# EAGLE board BaseBoard5 (EAGLE 6.5.0), part 1 of 2
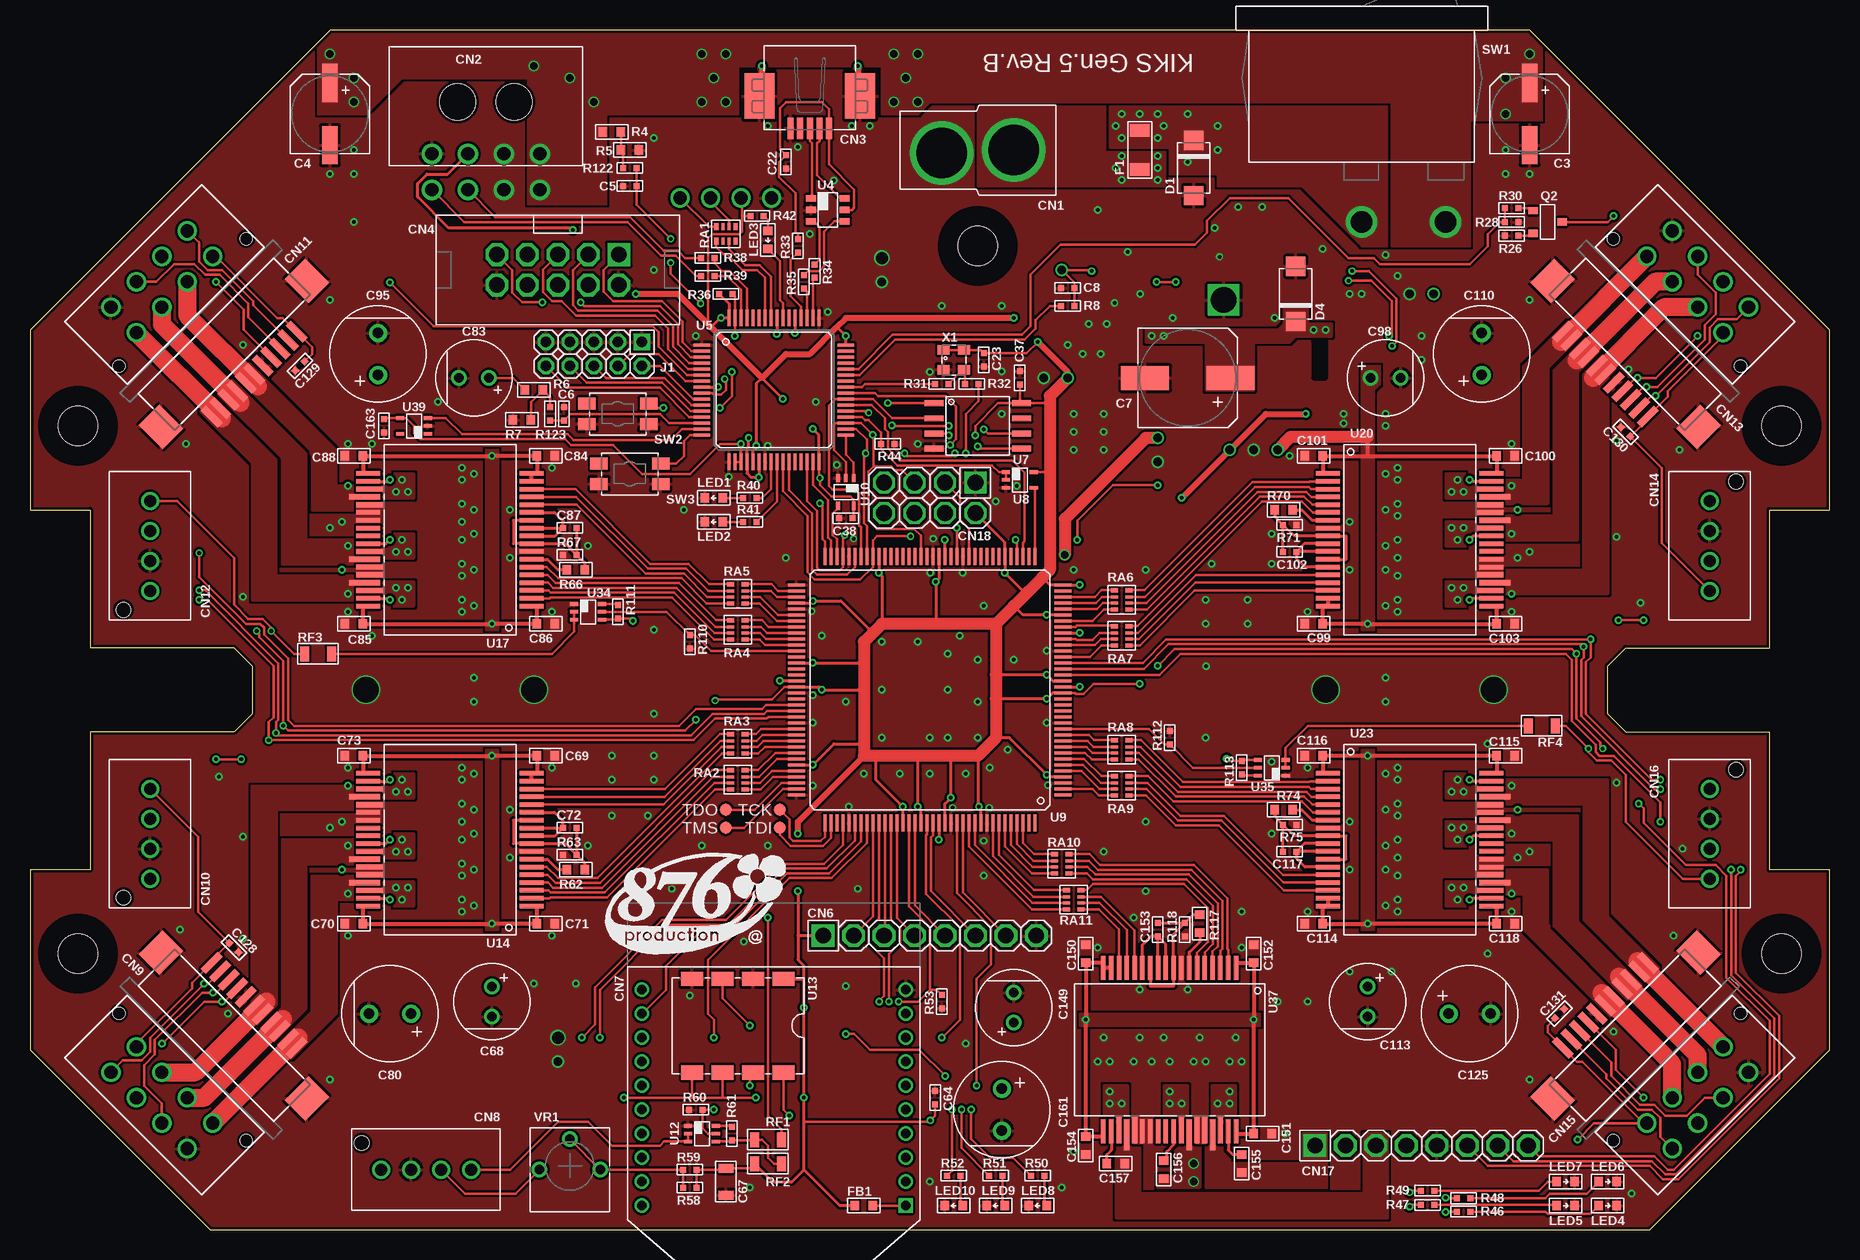
[diagram p8: board, top side]
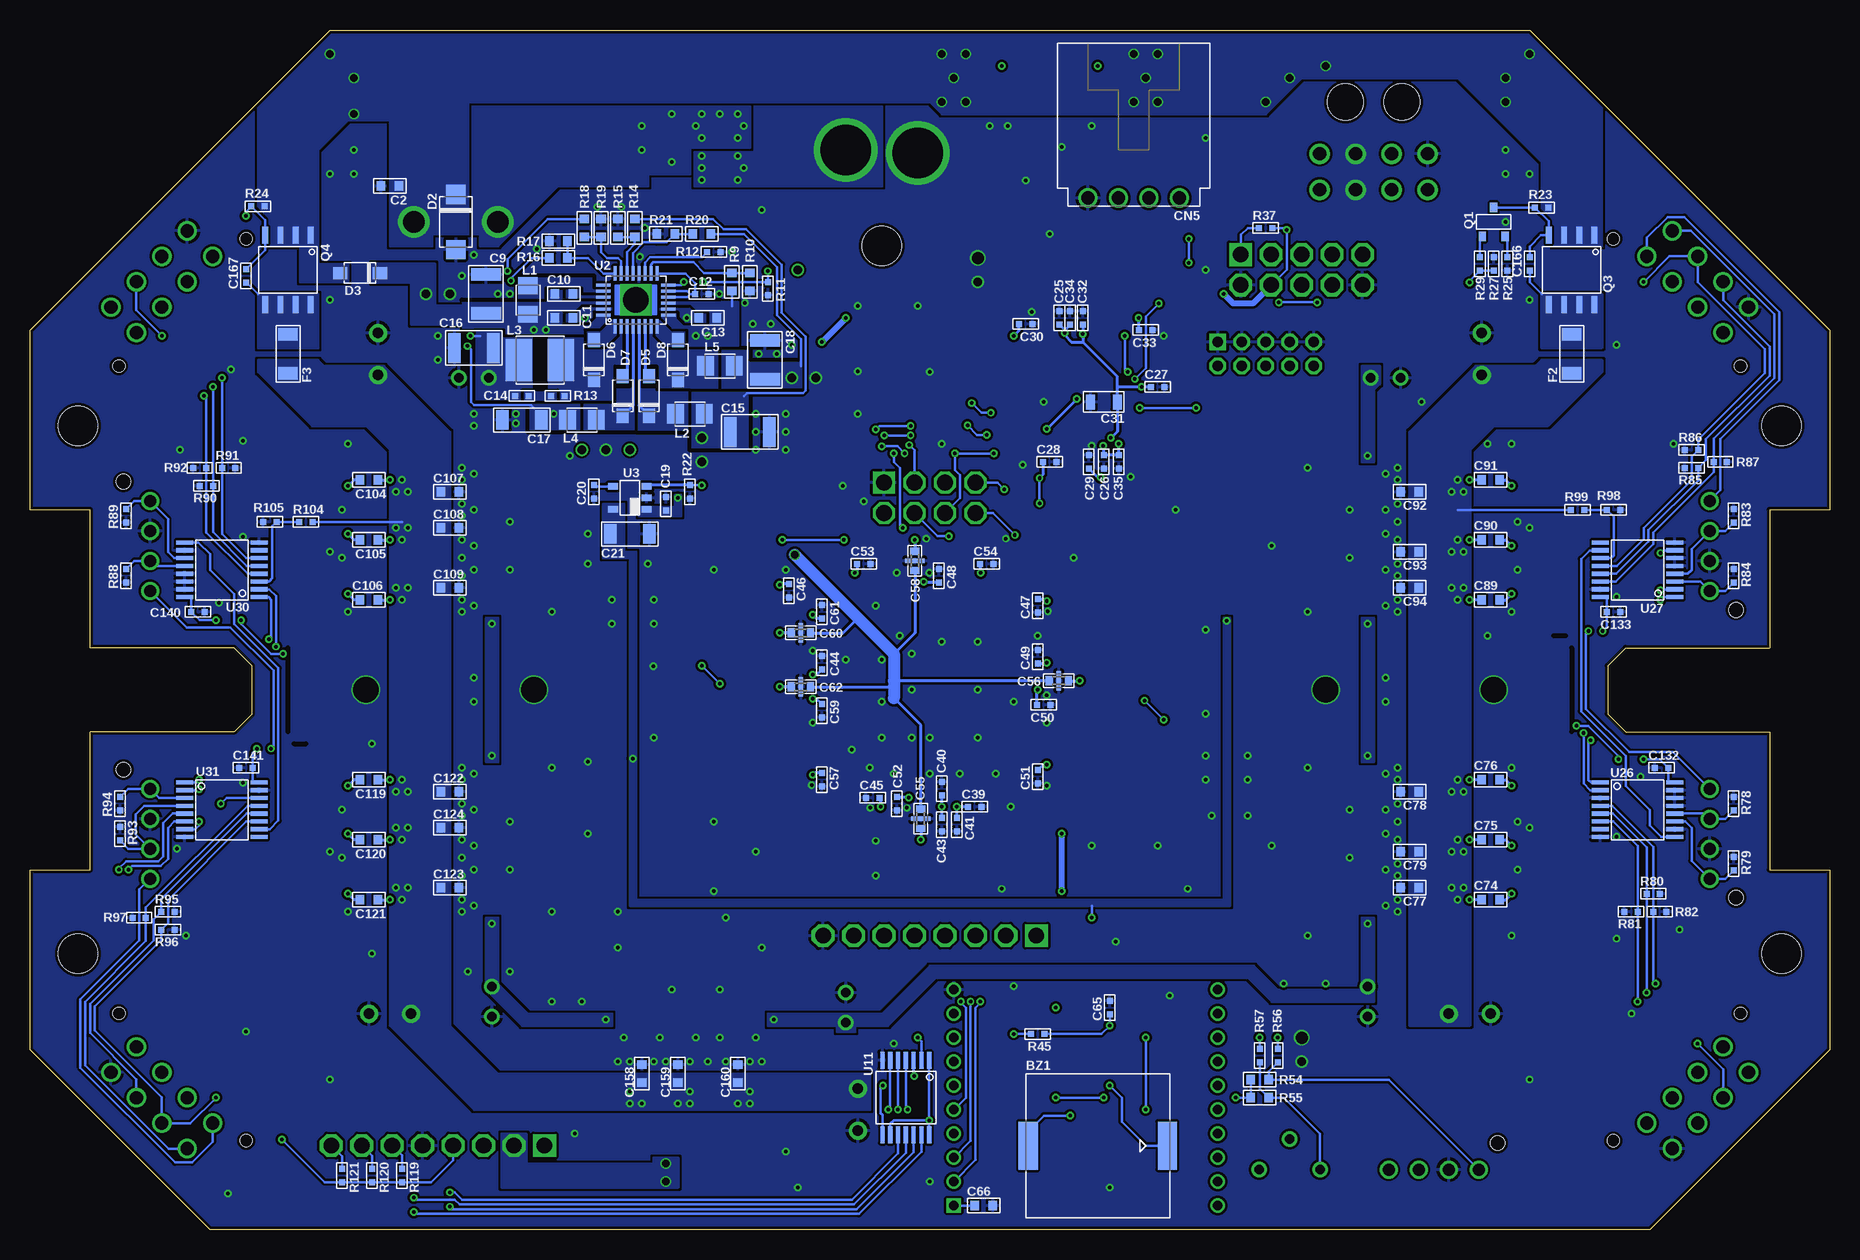
[diagram p9: board, bottom side, seen from below]

Size 150 x 100 mm. Coordinates in mm from the lower left corner, seen from the top.
Outline: 15,0 135,0 150,15 150,30 145,30 145,41.5 133,41.5 131.5,43 131.5,47 133,48.5 145,48.5 145,60 150,60 150,75 125,100 25,100 0,75 0,60 5,60 5,48.5 17,48.5 18.5,47 18.5,43 17,41.5 5,41.5 5,30 0,30 0,15 15,0
Copper layers (1*16): Top 0.035mm / dielectric 1.5mm / Bottom 0.035mm
Design rules "Elecrow_2-layer_eagle_rule *": minimum track width 6mil, minimum drill 0.3mm, track to track 6mil, track to pad 6mil, pad to pad 6mil, via to via 6mil, smd to smd 0mil, copper to edge 10mil, drill to drill 10mil, minimum pad ring 8mil, minimum via ring 6mil, stop-mask expansion 2mil, vias tented up to drill 100mil, thermal gap 10mil
Holes 3.3 mm at 4,67 4,23 146,23 146,67 79,82
tRestrict: area 76,79 to 82,85; area 1,64 to 7,70; area 1,20 to 7,26; area 143,20 to 149,26; area 143,64 to 149,70; 4 lines
bRestrict: 119 lines

## Footprints (pad centres in the part's own frame; a part is rotated, then mirrored left to right if it is on the bottom)
PKLCS1212 = smd 1.6 x 4: 1 -5.8,0; 2 5.8,0
1608 = smd 0.7 x 0.8: 1 -0.75,0; 2 0.75,0
ES-6.3 = smd 3.2 x 1.3: N 2.6,0; P -2.6,0
1005 = smd 0.5 x 0.5: 1 -0.55,0; 2 0.55,0
ES2-8 = smd 4 x 2: N 3.55,0; P -3.55,0
3225 = smd 1.05 x 2.5: 1 -1.625,0; 2 1.625,0
3216 = smd 1.05 x 1.6: 1 -1.625,0; 2 1.625,0
2012 = smd 0.75 x 1.25: 1 -1.125,0; 2 1.125,0
NFM18 = smd 0.6 x 0.8: 1 -0.8,0; 2 0.8,0 | smd 0.4 x 1.6: GND 0,0
E2.5-6.3 = drill 0.8 pad 1.3: N 1.25,0; P -1.25,0
E3.5-8 = drill 0.9 pad 1.5: N 1.75,0; P -1.75,0
T-CON = drill 4.2 pad 5.3: N -3,-0.25; P 3,0
43045-0800 = drill 1.1 pad 1.7: 1 -4.5,-4.32; 2 -1.5,-4.32; 3 1.5,-4.32; 4 4.5,-4.32; 5 -4.5,-7.32; 6 -1.5,-7.32; 7 1.5,-7.32; 8 4.5,-7.32 | hole 3: 2.35,0; -2.35,0
UX60SC-MB-5ST = smd 1.8 x 0.5: 1 2.7,1.6; 2 2.7,0.8; 3 2.7,0; 4 2.7,-0.8; 5 2.7,-1.6 | smd 3.8 x 2.5: S1 0,-4.2; S2 0,4.2
PIN2X5-BOX = drill 1.3 pad 1.9 square: 1 -5.08,-1.27 | drill 1.3 pad 1.9 octagon: 2 -5.08,1.27; 3 -2.54,-1.27; 4 -2.54,1.27; 5 0,-1.27; 6 0,1.27; 7 2.54,-1.27; 8 2.54,1.27; 9 5.08,-1.27; 10 5.08,1.27
70553-0003 = drill 1.1 pad 1.6: 1 3.81,0; 2 1.27,0; 3 -1.27,0; 4 -3.81,0
PIN1X8 = drill 1.3 pad 1.9 square: 1 -8.89,0 | drill 1.3 pad 1.9 octagon: 2 -6.35,0; 3 -3.81,0; 4 -1.27,0; 5 1.27,0; 6 3.81,0; 7 6.35,0; 8 8.89,0
XBEE-TH = drill 0.8 square: 1 -11,9 | drill 0.8: 2 -11,7; 3 -11,5; 4 -11,3; 5 -11,1; 6 -11,-1; 7 -11,-3; 8 -11,-5; 9 -11,-7; 10 -11,-9; 11 11,-9; 12 11,-7; 13 11,-5; 14 11,-3; 15 11,-1; 16 11,1; 17 11,3; 18 11,5; 19 11,7; 20 11,9
53375-04 = drill 1 pad 1.5: 1 3.75,0; 2 1.25,0; 3 -1.25,0; 4 -3.75,0 | hole 1.2: 5.35,-2.2
MOTOR_COMPLEX2 = smd 0.6 x 2: 1.1 5,-2.4; 1.2 4,-2.4; 1.3 3,-2.4; 1.4 2,-2.4; 1.5 1,-2.4; 1.6 0,-2.4; 1.7 -1,-2.4; 1.8 -2,-2.4; 1.9 -3,-2.4; 1.10 -4,-2.4; 1.11 -5,-2.4 | drill 1.1 pad 1.5: 2.1 -4.5,10; 2.2 -1.5,10; 2.3 1.5,10; 2.4 4.5,10; 2.5 -4.5,7; 2.6 -1.5,7; 2.7 1.5,7; 2.8 4.5,7 | smd 2.4 x 2.8: S1 -8.6,0; S2 8.6,0 | hole 1: -7.5,6.06; 7.5,6.06
PIN2X4 = drill 1.3 square: 1 -3.81,-1.27 | drill 1.3 octagon: 2 -3.81,1.27; 3 -1.27,-1.27; 4 -1.27,1.27; 5 1.27,-1.27; 6 1.27,1.27; 7 3.81,-1.27; 8 3.81,1.27
DO-214AC = smd 1.6 x 1.6: A 2.3,0; K -2.3,0
SOD123W = smd 1.2 x 1: A 1.65,0; K -1.65,0
PIN2X5-2.0 = drill 0.9 pad 1.3 square: 1 -4,-1 | drill 0.9 pad 1.3 octagon: 2 -4,1; 3 -2,-1; 4 -2,1; 5 0,-1; 6 0,1; 7 2,-1; 8 2,1; 9 4,-1; 10 4,1
L2520 = smd 1.4 x 1.65: 1 -1.2,0; 2 1.2,0
L4040 = smd 2.2 x 3.5: 1 -1.75,0; 2 1.75,0
1608' = smd 0.7 x 0.8: A 0.75,0; K -0.75,0
PAD = smd 1 x 1: 1 0,0
SOT23-3 = smd 0.6 x 0.8: 1 -0.95,-1.2; 2 0.95,-1.2; 3 0,1.2
SOP8 = smd 0.48 x 1.4: 1 -1.905,-2.9; 2 -0.635,-2.9; 3 0.635,-2.9; 4 1.905,-2.9; 5 1.905,2.9; 6 0.635,2.9; 7 -0.635,2.9; 8 -1.905,2.9
1005-A4 = smd 0.6 x 0.35: A1 -0.6,0.8; A2 0.6,0.8; D1 -0.6,-0.8; D2 0.6,-0.8 | smd 0.6 x 0.25: B1 -0.6,0.25; B2 0.6,0.25; C1 -0.6,-0.25; C2 0.6,-0.25
SLE6_10A4 = drill 1.8 pad 2.6: 1 0,7; P 0,0
EVQ-P2_P9 = smd 1.45 x 1: A1 -2.575,-0.85; A2 2.575,-0.85; B1 -2.575,0.85; B2 2.575,0.85
QFN28-0.5-PAD = smd 1.2 x 0.25: 1 -2.2,1.75; 2 -2.2,1.25; 3 -2.2,0.75; 4 -2.2,0.25; 5 -2.2,-0.25; 6 -2.2,-0.75; 7 -2.2,-1.25; 8 -2.2,-1.75; 15 2.2,-1.75; 16 2.2,-1.25; 17 2.2,-0.75; 18 2.2,-0.25; 19 2.2,0.25; 20 2.2,0.75; 21 2.2,1.25; 22 2.2,1.75 | smd 0.25 x 1.2: 9 -1.25,-2.7; 10 -0.75,-2.7; 11 -0.25,-2.7; 12 0.25,-2.7; 13 0.75,-2.7; 14 1.25,-2.7; 23 1.25,2.7; 24 0.75,2.7; 25 0.25,2.7; 26 -0.25,2.7; 27 -0.75,2.7; 28 -1.25,2.7 | drill 2.1 pad 2.6 square: PAD 0,0
SOT23-5 = smd 0.55 x 0.85: 1 -0.95,-1.4; 2 0,-1.4; 3 0.95,-1.4; 4 0.95,1.4; 5 -0.95,1.4
SOT23-6 = smd 0.55 x 0.85: 1 -0.95,-1.4; 2 0,-1.4; 3 0.95,-1.4; 4 0.95,1.4; 5 0,1.4; 6 -0.95,1.4
QFP64-0.5 = smd 1.4 x 0.25: 1 -6,3.75; 2 -6,3.25; 3 -6,2.75; 4 -6,2.25; 5 -6,1.75; 6 -6,1.25; 7 -6,0.75; 8 -6,0.25; 9 -6,-0.25; 10 -6,-0.75; 11 -6,-1.25; 12 -6,-1.75; 13 -6,-2.25; 14 -6,-2.75; 15 -6,-3.25; 16 -6,-3.75; 33 6,-3.75; 34 6,-3.25; 35 6,-2.75; 36 6,-2.25; 37 6,-1.75; 38 6,-1.25; 39 6,-0.75; 40 6,-0.25; 41 6,0.25; 42 6,0.75; 43 6,1.25; 44 6,1.75; 45 6,2.25; 46 6,2.75; 47 6,3.25; 48 6,3.75 | smd 0.25 x 1.4: 17 -3.75,-6; 18 -3.25,-6; 19 -2.75,-6; 20 -2.25,-6; 21 -1.75,-6; 22 -1.25,-6; 23 -0.75,-6; 24 -0.25,-6; 25 0.25,-6; 26 0.75,-6; 27 1.25,-6; 28 1.75,-6; 29 2.25,-6; 30 2.75,-6; 31 3.25,-6; 32 3.75,-6; 49 3.75,6; 50 3.25,6; 51 2.75,6; 52 2.25,6; 53 1.75,6; 54 1.25,6; 55 0.75,6; 56 0.25,6; 57 -0.25,6; 58 -0.75,6; 59 -1.25,6; 60 -1.75,6; 61 -2.25,6; 62 -2.75,6; 63 -3.25,6; 64 -3.75,6
SOP8W = smd 0.48 x 1.6: 1 -1.905,-3.65; 2 -0.635,-3.65; 3 0.635,-3.65; 4 1.905,-3.65; 5 1.905,3.65; 6 0.635,3.65; 7 -0.635,3.65; 8 -1.905,3.65
SC70-5 = smd 0.3 x 0.7: 1 -0.65,-1.15; 2 0,-1.15; 3 0.65,-1.15; 4 0.65,1.15; 5 -0.65,1.15
QFP144-0.5 = smd 1.4 x 0.25: 1 -11.1,8.75; 2 -11.1,8.25; 3 -11.1,7.75; 4 -11.1,7.25; 5 -11.1,6.75; 6 -11.1,6.25; 7 -11.1,5.75; 8 -11.1,5.25; 9 -11.1,4.75; 10 -11.1,4.25; 11 -11.1,3.75; 12 -11.1,3.25; 13 -11.1,2.75; 14 -11.1,2.25; 15 -11.1,1.75; 16 -11.1,1.25; 17 -11.1,0.75; 18 -11.1,0.25; 19 -11.1,-0.25; 20 -11.1,-0.75; 21 -11.1,-1.25; 22 -11.1,-1.75; 23 -11.1,-2.25; 24 -11.1,-2.75; 25 -11.1,-3.25; 26 -11.1,-3.75; 27 -11.1,-4.25; 28 -11.1,-4.75; 29 -11.1,-5.25; 30 -11.1,-5.75; 31 -11.1,-6.25; 32 -11.1,-6.75; 33 -11.1,-7.25; 34 -11.1,-7.75; 35 -11.1,-8.25; 36 -11.1,-8.75; 73 11.1,-8.75; 74 11.1,-8.25; 75 11.1,-7.75; 76 11.1,-7.25; 77 11.1,-6.75; 78 11.1,-6.25; 79 11.1,-5.75; 80 11.1,-5.25; 81 11.1,-4.75; 82 11.1,-4.25; 83 11.1,-3.75; 84 11.1,-3.25; 85 11.1,-2.75; 86 11.1,-2.25; 87 11.1,-1.75; 88 11.1,-1.25; 89 11.1,-0.75; 90 11.1,-0.25; 91 11.1,0.25; 92 11.1,0.75; 93 11.1,1.25; 94 11.1,1.75; 95 11.1,2.25; 96 11.1,2.75; 97 11.1,3.25; 98 11.1,3.75; 99 11.1,4.25; 100 11.1,4.75; 101 11.1,5.25; 102 11.1,5.75; 103 11.1,6.25; 104 11.1,6.75; 105 11.1,7.25; 106 11.1,7.75; 107 11.1,8.25; 108 11.1,8.75 | smd 0.25 x 1.4: 37 -8.75,-11.1; 38 -8.25,-11.1; 39 -7.75,-11.1; 40 -7.25,-11.1; 41 -6.75,-11.1; 42 -6.25,-11.1; 43 -5.75,-11.1; 44 -5.25,-11.1; 45 -4.75,-11.1; 46 -4.25,-11.1; 47 -3.75,-11.1; 48 -3.25,-11.1; 49 -2.75,-11.1; 50 -2.25,-11.1; 51 -1.75,-11.1; 52 -1.25,-11.1; 53 -0.75,-11.1; 54 -0.25,-11.1; 55 0.25,-11.1; 56 0.75,-11.1; 57 1.25,-11.1; 58 1.75,-11.1; 59 2.25,-11.1; 60 2.75,-11.1; 61 3.25,-11.1; 62 3.75,-11.1; 63 4.25,-11.1; 64 4.75,-11.1; 65 5.25,-11.1; 66 5.75,-11.1; 67 6.25,-11.1; 68 6.75,-11.1; 69 7.25,-11.1; 70 7.75,-11.1; 71 8.25,-11.1; 72 8.75,-11.1; 109 8.75,11.1; 110 8.25,11.1; 111 7.75,11.1; 112 7.25,11.1; 113 6.75,11.1; 114 6.25,11.1; 115 5.75,11.1; 116 5.25,11.1; 117 4.75,11.1; 118 4.25,11.1; 119 3.75,11.1; 120 3.25,11.1; 121 2.75,11.1; 122 2.25,11.1; 123 1.75,11.1; 124 1.25,11.1; 125 0.75,11.1; 126 0.25,11.1; 127 -0.25,11.1; 128 -0.75,11.1; 129 -1.25,11.1; 130 -1.75,11.1; 131 -2.25,11.1; 132 -2.75,11.1; 133 -3.25,11.1; 134 -3.75,11.1; 135 -4.25,11.1; 136 -4.75,11.1; 137 -5.25,11.1; 138 -5.75,11.1; 139 -6.25,11.1; 140 -6.75,11.1; 141 -7.25,11.1; 142 -7.75,11.1; 143 -8.25,11.1; 144 -8.75,11.1
TSSOP14 = smd 0.35 x 1.4: 1 -1.95,-3.1; 2 -1.3,-3.1; 3 -0.65,-3.1; 4 0,-3.1; 5 0.65,-3.1; 6 1.3,-3.1; 7 1.95,-3.1; 8 1.95,3.1; 9 1.3,3.1; 10 0.65,3.1; 11 0,3.1; 12 -0.65,3.1; 13 -1.3,3.1; 14 -1.95,3.1
SC70-6 = smd 0.3 x 0.7: 1 -0.65,-1.15; 2 0,-1.15; 3 0.65,-1.15; 4 0.65,1.15; 5 0,1.15; 6 -0.65,1.15
AE-NJU72501 = smd 1.2 x 1.8: 1 -3.9,3.81; 2 -3.9,1.27; 3 -3.9,-1.27; 4 -3.9,-3.81; 5 3.9,-3.81; 6 3.9,-1.27; 7 3.9,1.27; 8 3.9,3.81
HSSOP36 = smd 0.381 x 2: 1 -5.525,-6.8; 2 -4.875,-6.8; 3 -4.225,-6.8; 4 -3.575,-6.8; 5 -2.925,-6.8; 6 -2.275,-6.8; 7 -1.625,-6.8; 8 -0.975,-6.8; 9 -0.325,-6.8; 10 0.325,-6.8; 11 0.975,-6.8; 12 1.625,-6.8; 13 2.275,-6.8; 14 2.925,-6.8; 15 3.575,-6.8; 16 4.225,-6.8; 17 4.875,-6.8; 18 5.525,-6.8; 19 5.525,6.8; 20 4.875,6.8; 24 2.275,6.8; 25 1.625,6.8; 26 0.975,6.8; 27 0.325,6.8; 28 -0.325,6.8; 35 -4.875,6.8; 36 -5.525,6.8 | smd 0.44 x 2.3: 21 4.225,6.65; 23 2.925,6.65; 29 -0.975,6.65; 31 -2.275,6.65; 32 -2.925,6.65; 34 -4.225,6.65 | smd 0.44 x 2.6: 22 3.575,7.1; 30 -1.625,7.1; 33 -3.575,7.1
TSSOP16 = smd 0.35 x 1.4: 1 -2.275,-3.1; 2 -1.625,-3.1; 3 -0.975,-3.1; 4 -0.325,-3.1; 5 0.325,-3.1; 6 0.975,-3.1; 7 1.625,-3.1; 8 2.275,-3.1; 9 2.275,3.1; 10 1.625,3.1; 11 0.975,3.1; 12 0.325,3.1; 13 -0.325,3.1; 14 -0.975,3.1; 15 -1.625,3.1; 16 -2.275,3.1
VR = drill 0.8 pad 1.3: A -2.54,0; B 2.54,0; W 0,2.54
OSC2520 = smd 0.8 x 1: 1 -0.825,-0.85; 2 0.825,-0.85; 3 0.825,0.85; 4 -0.825,0.85

## Placement (x,y rotation side)
BZ1  [PKLCS1212]  61,7 0 bottom
C2  100n  [1608]  120,87 180 bottom
C3  100u  [ES-6.3]  125,93 270 top
C4  100u  [ES-6.3]  25,93 270 top
C5  10n  [1005]  50,87 180 top
C6  10n  [1005]  44.5,68 90 top
C7  330u  [ES2-8]  96.5,71 180 top
C8  1u  [1005]  86.5,78.5 180 top
C9  22u  [3225]  112,78 90 bottom
C10  1u  [1608]  105.5,78 180 bottom
C11  1u  [1608]  105.5,76 0 bottom
C12  10n  [1005]  94,78 0 bottom
C13  1u  [1608]  93.5,76 180 bottom
C14  1n  [1005]  109,69.5 180 bottom
C15  100u  [3225]  90,66.5 0 bottom
C16  22u  [3225]  113,73.5 180 bottom
C17  22u  [3216]  109,67.5 180 bottom
C18  100u  [3225]  88.75,72.5 90 bottom
C19  1u  [1005]  97,60.5 90 bottom
C20  10n  [1005]  103,61.5 270 bottom
C21  22u  [3216]  100,58 0 bottom
C22  100n  [1005]  63,89 270 top
C23  10n  [1005]  79.5,72.5 270 top
C25  1n  [1005]  64.2,76 90 bottom
C26  100n  [1005]  60.5,64 270 bottom
C27  100n  [1005]  56,70.25 0 bottom
C28  100n  [1005]  65,64 0 bottom
C29  100n  [1005]  61.75,64 90 bottom
C30  100n  [1005]  67,75.5 0 bottom
C31  22u  [2012]  60.5,69 180 bottom
C32  100n  [1005]  62.25,76 90 bottom
C33  100n  [1005]  57,75 0 bottom
C34  100n  [1005]  63.3,76 90 bottom
C35  100n  [1005]  59.25,64 270 bottom
C37  100n  [1005]  82.5,71 90 top
C38  100n  [1005]  68,59.3 180 top
C39  1n  [1005]  71.25,35.25 0 bottom
C40  1n  [1005]  74,36.75 90 bottom
C41  100n  [1005]  72.75,33.75 270 bottom
C43  100n  [1005]  74,33.75 270 bottom
C44  100n  [1005]  84,47.25 90 bottom
C45  100n  [1005]  79.75,36 180 bottom
C46  100n  [1005]  86.75,53.25 270 bottom
C47  100n  [1005]  66,52 270 bottom
C48  100n  [1005]  74.25,54.5 90 bottom
C49  100n  [1005]  66,47.75 90 bottom
C50  100n  [1005]  65.5,43.75 0 bottom
C51  100n  [1005]  66,37.75 270 bottom
C52  100n  [1005]  77.75,35.5 270 bottom
C53  100n  [1005]  80.5,55.5 0 bottom
C54  100n  [1005]  70.25,55.5 0 bottom
C55  100n  [NFM18]  75.75,34.25 90 bottom
C56  100n  [NFM18]  64.25,45.75 180 bottom
C57  100n  [1005]  84,37.5 270 bottom
C58  100n  [NFM18]  76.25,55.75 270 bottom
C59  100n  [1005]  84,43.25 270 bottom
C60  100n  [NFM18]  85.75,49.75 0 bottom
C61  100n  [1005]  84,51.5 90 bottom
C62  100n  [NFM18]  85.75,45.25 0 bottom
C64  1u  [1005]  75.45,11 90 top
C65  1n  [1005]  60,18.5 90 bottom
C66  1u  [1608]  70.5,2 0 bottom
C67  22u  [2012]  58,4 270 top
C68  100u  [E2.5-6.3]  38.5,19 270 top
C69  1u  [1608]  43,39.5 0 top
C70  1u  [1608]  27,25.5 180 top
C71  1u  [1608]  43,25.5 0 top
C72  100n  [1005]  45,33.5 0 top
C73  1u  [1608]  27,39.5 180 top
C74  100n  [1608]  28.25,27.5 0 bottom
C75  100n  [1608]  28.25,32.5 0 bottom
C76  100n  [1608]  28.25,37.5 0 bottom
C77  100n  [1608]  35,28.5 180 bottom
C78  100n  [1608]  35,36.5 180 bottom
C79  100n  [1608]  35,31.5 180 bottom
C80  220u  [E3.5-8]  30,18 180 top
C83  100u  [E2.5-6.3]  37,71 180 top
C84  1u  [1608]  43,64.5 0 top
C85  1u  [1608]  27,50.5 180 top
C86  1u  [1608]  43,50.5 0 top
C87  100n  [1005]  45,58.5 0 top
C88  1u  [1608]  27,64.5 180 top
C89  100n  [1608]  28.25,52.5 0 bottom
C90  100n  [1608]  28.25,57.5 0 bottom
C91  100n  [1608]  28.25,62.5 0 bottom
C92  100n  [1608]  35,61.5 180 bottom
C93  100n  [1608]  35,56.5 180 bottom
C94  100n  [1608]  35,53.5 180 bottom
C95  220u  [E3.5-8]  29,73 90 top
C98  100u  [E2.5-6.3]  113,71 0 top
C99  1u  [1608]  107,50.5 180 top
C100  1u  [1608]  123,64.5 0 top
C101  1u  [1608]  107,64.5 180 top
C102  100n  [1005]  105,56.5 180 top
C103  1u  [1608]  123,50.5 0 top
C104  100n  [1608]  121.75,62.5 180 bottom
C105  100n  [1608]  121.75,57.5 180 bottom
C106  100n  [1608]  121.75,52.5 180 bottom
C107  100n  [1608]  115,61.5 0 bottom
C108  100n  [1608]  115,58.5 0 bottom
C109  100n  [1608]  115,53.5 0 bottom
C110  220u  [E3.5-8]  121,73 90 top
C113  100u  [E2.5-6.3]  111.5,19 270 top
C114  1u  [1608]  107,25.5 180 top
C115  1u  [1608]  123,39.5 0 top
C116  1u  [1608]  107,39.5 180 top
C117  100n  [1005]  105,31.5 180 top
C118  1u  [1608]  123,25.5 0 top
C119  100n  [1608]  121.75,37.5 180 bottom
C120  100n  [1608]  121.75,32.5 180 bottom
C121  100n  [1608]  121.75,27.5 180 bottom
C122  100n  [1608]  115,36.5 0 bottom
C123  100n  [1608]  115,28.5 0 bottom
C124  100n  [1608]  115,33.5 0 bottom
C125  220u  [E3.5-8]  120,18 0 top
C128  1u  [1005]  17,23.5 315 top
C129  1u  [1005]  22.5,72 225 top
C130  1u  [1005]  133,66.5 135 top
C131  1u  [1005]  127.5,18 45 top
C132  100n  [1005]  14,38.5 180 bottom
C133  100n  [1005]  18,51.5 0 bottom
C140  100n  [1005]  136,51.5 0 bottom
C141  100n  [1005]  132,38.5 180 bottom
C149  100u  [E2.5-6.3]  82,18.5 90 top
C150  1u  [1608]  88,23 90 top
C151  1u  [1608]  102.75,8 0 top
C152  1u  [1608]  102,23 90 top
C153  100n  [1005]  94,25 90 top
C154  1u  [1608]  88,7 270 top
C155  100n  [1608]  101,5.5 270 top
C156  100n  [1608]  94.5,5 270 top
C157  100n  [1608]  90.5,5.5 0 top
C158  100n  [1608]  99,13 90 bottom
C159  100n  [1608]  96,13 90 bottom
C160  100n  [1608]  91,13 90 bottom
C161  220u  [E3.5-8]  81,10 270 top
C163  100n  [1005]  29.5,67 270 top
C166  10n  [1005]  25,80.5 90 bottom
C167  10n  [1005]  132,79.5 90 bottom
CN1  Battery  [T-CON]  79,90 0 top
CN2  Kicker  [43045-0800]  38,94 0 top
CN3  UX60SC-MB-5ST  [UX60SC-MB-5ST]  65,94.5 270 top
CN4  CN-JTAG_ALTERA-BOX  [PIN2X5-BOX]  44,80.01 180 top
CN5  Debug  [70553-0003]  58,86 0 bottom
CN6  External SPI 1  [PIN1X8]  75,24.5 0 top
CN7  XBee  [XBEE-TH]  62,11 180 top
CN8  Ball Sensor  [53375-04]  33,5 180 top
CN9  EC45FLAT2  [MOTOR_COMPLEX2]  17,17 135 top
CN10  Motor1  [53375-04]  10,33 270 top
CN11  EC45FLAT2  [MOTOR_COMPLEX2]  17,73 45 top
CN12  Motor2  [53375-04]  10,57 270 top
CN13  EC45FLAT2  [MOTOR_COMPLEX2]  133,73 315 top
CN14  Motor3  [53375-04]  140,57 90 top
CN15  EC45FLAT2  [MOTOR_COMPLEX2]  133,17 225 top
CN16  Motor4  [53375-04]  140,33 90 top
CN17  Dribble  [PIN1X8]  116,7 0 top
CN18  External SPI 2  [PIN2X4]  75,61 180 top
D1  SMAJ22A  [DO-214AC]  97,88.5 270 top
D2  SMAJ22A  [DO-214AC]  114.5,84 270 bottom
D3  PMEG4030ER  [SOD123W]  122.5,79.75 180 bottom
D4  SMAJ24A  [DO-214AC]  105.5,78 90 top
D5  PMEG4030ER  [SOD123W]  98.4,69.5 90 bottom
D6  PMEG4030ER  [SOD123W]  103,72.5 90 bottom
D7  PMEG4030ER  [SOD123W]  100.6,69.5 90 bottom
D8  PMEG4030ER  [SOD123W]  96,72.5 90 bottom
F1  15  [3216]  92.5,90 90 top
F2  10  [3216]  21.5,73 270 bottom
F3  10  [3216]  128.5,73 270 bottom
FB1  [1608]  69.5,2 0 top
J1  Setting  [PIN2X5-2.0]  47,73 180 top
L1  4.7u  [L2520]  108.5,77.5 90 bottom
L2  3.3u  [L2520]  95,68 0 bottom
L3  10u  [L4040]  107.5,72.5 180 bottom
L4  4.7u  [L2520]  104,67.5 180 bottom
L5  4.7u  [L2520]  92.5,72 0 bottom
LED1  [1608']  57,61 0 top
LED2  [1608']  57,59 0 top
LED3  [1608']  61.5,82.5 90 top
LED4  [1608']  131.5,2 180 top
LED5  [1608']  128,2 180 top
LED6  [1608']  131.5,4 180 top
LED7  [1608']  128,4 180 top
LED8  [1608']  84,2 0 top
LED9  [1608']  80.5,2 0 top
LED10  [1608']  77,2 0 top
LOGO1  LOGO-876_SMALL  [LOGO-876_SMALL]  48,23 0 top
P1  TCK  [PAD]  62.5,35 180 top
P2  TDI  [PAD]  62.5,33.5 180 top
P3  TDO  [PAD]  58,35 180 top
P4  TMS  [PAD]  58,33.5 180 top
Q1  [SOT23-3]  28,84 0 bottom
Q2  [SOT23-3]  126.5,84 270 top
Q3  Si4483ADY  [SOP8]  21.5,80 180 bottom
Q4  Si4483ADY  [SOP8]  128.5,80 180 bottom
R4  100k  [1608]  48.5,91.5 180 top
R5  10k  [1608]  50,90 180 top
R6  100k  [1608]  42,70 180 top
R7  10k  [1608]  41,67.5 0 top
R8  10k  [1005]  86.5,77 0 top
R9  100k  [1608]  91.5,79 270 bottom
R10  24k  [1608]  90,79 90 bottom
R11  10k  [1005]  88.5,78.45 90 bottom
R12  10k  [1005]  93,81.5 180 bottom
R13  1k  [1005]  106,69.5 0 bottom
R14  3.9k  [1608]  99.6,83.5 90 bottom
R15  7.5k  [1608]  101,83.5 270 bottom
R16  24k  [1608]  105.95,81 180 bottom
R17  1.65k  [1608]  105.95,82.4 0 bottom
R18  24k  [1608]  103.8,83.5 90 bottom
R19  3.9k  [1608]  102.4,83.5 270 bottom
R20  24k  [1608]  94,83 0 bottom
R21  7.5k  [1608]  97,83 0 bottom
R22  10k  [1005]  95,61.5 90 bottom
R23  33k  [1005]  24,85.2 0 bottom
R24  33k  [1005]  131,85.3 0 bottom
R25  1k  [1005]  26.85,80.5 90 bottom
R26  1k  [1005]  123.5,82.85 0 top
R27  10k  [1005]  28,80.5 270 bottom
R28  10k  [1005]  123.5,84 180 top
R29  51  [1005]  29.15,80.5 270 bottom
R30  51  [1005]  123.5,85.15 180 top
R31  51  [1005]  76,70.5 180 top
R32  51  [1005]  78.5,70.5 0 top
R33  51  [1005]  64,82 90 top
R34  22  [1005]  65.4,79.9 270 top
R35  22  [1005]  64.5,79 270 top
R36  10k  [1005]  58,78 180 top
R37  10k  [1005]  47,83.5 0 bottom
R38  51  [1005]  56.5,81 180 top
R39  51  [1005]  56.5,79.5 180 top
R40  1k  [1005]  60,61 0 top
R41  1k  [1005]  60,59 0 top
R42  1k  [1005]  60.6,84.5 180 top
R44  10k  [1005]  71.5,65.5 180 top
R45  10k  [1005]  66,16.3 180 bottom
R46  1k  [1005]  119.5,1.5 180 top
R47  1k  [1005]  116.5,2.05 180 top
R48  1k  [1005]  119.5,2.6 180 top
R49  1k  [1005]  116.5,3.25 180 top
R50  1k  [1005]  84,4.5 180 top
R51  1k  [1005]  80.5,4.5 180 top
R52  1k  [1005]  77,4.5 180 top
R53  10k  [1005]  76,19 90 top
R54  3.9k  [1608]  47.5,12.5 180 bottom
R55  3.9k  [1608]  47.5,11 180 bottom
R56  1k  [1005]  46,14.5 90 bottom
R57  51  [1005]  47.5,14.5 90 bottom
R58  51  [1005]  55,3.5 0 top
R59  51  [1005]  55,5 0 top
R60  10k  [1005]  55.5,10 0 top
R61  10k  [1005]  58.5,8 270 top
R62  33k  [1608]  45.5,30 180 top
R63  1  [1005]  45,31.25 0 top
R66  33k  [1608]  45.5,55 180 top
R67  1  [1005]  45,56.25 0 top
R70  33k  [1608]  104.5,60 0 top
R71  1  [1005]  105,58.75 180 top
R74  33k  [1608]  104.5,35 0 top
R75  1  [1005]  105,33.75 180 top
R78  100k  [1005]  8,35.5 270 bottom
R79  100k  [1005]  8,30.5 270 bottom
R80  100k  [1005]  14.7,28 180 bottom
R81  100k  [1005]  16.55,26.5 0 bottom
R82  100k  [1005]  14.15,26.5 180 bottom
R83  100k  [1005]  8,59.5 270 bottom
R84  100k  [1005]  8,54.5 270 bottom
R85  100k  [1005]  11.5,63.5 0 bottom
R86  100k  [1005]  11.5,65 0 bottom
R87  100k  [1005]  9.1,64 180 bottom
R88  100k  [1005]  142,54.5 90 bottom
R89  100k  [1005]  142,59.5 90 bottom
R90  100k  [1005]  135.3,62 0 bottom
R91  100k  [1005]  133.45,63.5 180 bottom
R92  100k  [1005]  135.85,63.5 0 bottom
R93  100k  [1005]  142.5,33 270 bottom
R94  100k  [1005]  142.5,35.5 90 bottom
R95  100k  [1005]  138.5,26.5 180 bottom
R96  100k  [1005]  138.5,25 180 bottom
R97  100k  [1005]  140.9,26 0 bottom
R98  33k  [1005]  18,60 180 bottom
R99  100k  [1005]  21,60 180 bottom
R104  100k  [1005]  127,59 180 bottom
R105  33k  [1005]  130,59 0 bottom
R110  10k  [1005]  55,49 90 top
R111  10k  [1005]  49,51.5 270 top
R112  10k  [1005]  95,41 270 top
R113  10k  [1005]  101,38.5 90 top
R117  33k  [1608]  97.5,25.5 270 top
R118  1  [1005]  96.25,25 90 top
R119  10k  [1005]  119,4.5 270 bottom
R120  10k  [1005]  121.5,4.5 270 bottom
R121  10k  [1005]  124,4.5 270 bottom
R122  1k  [1005]  50,88.5 0 top
R123  1k  [1005]  43.35,68 270 top
RA1  51  [1005-A4]  58,83 90 top
RA2  51  [1005-A4]  59,37.5 180 top
RA3  51  [1005-A4]  59,40.5 180 top
RA4  51  [1005-A4]  59,50 180 top
RA5  51  [1005-A4]  59,53 180 top
RA6  51  [1005-A4]  91,52.5 0 top
RA7  51  [1005-A4]  91,49.5 0 top
RA8  51  [1005-A4]  91,40 0 top
RA9  51  [1005-A4]  91,37 0 top
RA10  51  [1005-A4]  86,30.5 0 top
RA11  51  [1005-A4]  87,27.5 0 top
RF1  200m  [2012]  61.5,7.5 0 top
RF2  200m  [2012]  61.5,5.5 180 top
RF3  200m  [2012]  24,48 0 top
RF4  200m  [2012]  126,42 180 top
SW1  Power  [SLE6_10A4]  111,84 270 top
SW2  [EVQ-P2_P9]  49,68 0 top
SW3  [EVQ-P2_P9]  50,63 0 top
U2  LT3504  [QFN28-0.5-PAD]  99.5,77.5 90 bottom
U3  SPX3819-50  [SOT23-5]  100,61 90 bottom
U4  IP4234CZ6  [SOT23-6]  66.5,85 270 top
U5  AT32UC3B0512-AU  [QFP64-0.5]  62,70 0 top
U7  MX25L6445EM  [SOP8W]  79,67 270 top
U8  1G08DCK  [SC70-5]  82.5,62.5 270 top
U9  XC6SLX9-TQ144  [QFP144-0.5]  75,45 180 top
U10  1G08DCK  [SC70-5]  68,61.5 180 top
U11  TC74VHC164FT  [TSSOP14]  77,11 180 bottom
U12  FDG6323L  [SC70-6]  56,8 270 top
U13  AE-NJU72501  [AE-NJU72501]  59,17 270 top
U14  DRV8332  [HSSOP36]  35,32.5 90 top
U17  DRV8332  [HSSOP36]  35,57.5 90 top
U20  DRV8332  [HSSOP36]  115,57.5 270 top
U23  DRV8332  [HSSOP36]  115,32.5 270 top
U26  TC74VHC165FT  [TSSOP16]  16,35 270 bottom
U27  TC74VHC165FT  [TSSOP16]  16,55 90 bottom
U30  TC74VHC165FT  [TSSOP16]  134,55 90 bottom
U31  TC74VHC165FT  [TSSOP16]  134,35 270 bottom
U34  FDG6323L  [SC70-6]  46.5,51.5 270 top
U35  FDG6323L  [SC70-6]  103.5,38.5 90 top
U37  DRV8332  [HSSOP36]  95,15 180 top
U39  MCP9701/LT  [SC70-5]  32,67 90 top
VR1  500  [VR]  45,5 0 top
X1  24MHz  [OSC2520]  77,72.5 270 top